# Altium schematic sheet SensorSchematic.SchDoc
size A4; SheetNumber: 1; SheetTotal: 1
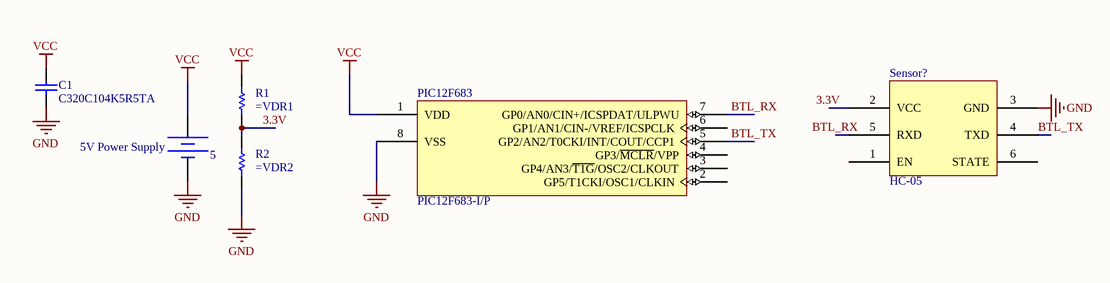
[diagram p0: SensorSchematic.SchDoc]

## Parts
5V_Power_Supply  DC Magnitude: 5  (hidden comment: Constant Voltage Source)
C1  C320C104K5R5TA  [CAPR51-254-508X318X736]
PIC12F683  PIC12F683-I/P  [PDIP300-P8]
R1  Resistor  (value not drawn)
R2  Resistor  (value not drawn)
Sensor?  HC-05  [HC-05]

## Nets
GND: 5V_Power_Supply.2 C1.1 PIC12F683.8(VSS) R2.1 Sensor?.3(GND)
VCC: 5V_Power_Supply.1 C1.2 PIC12F683.1(VDD) R1.1
3.3V: R1.2 R2.2 Sensor?.2(VCC)
BTL_RX: PIC12F683.7(GP0/AN0/CIN+/ICSPDAT/ULPWU) Sensor?.5(RXD)
BTL_TX: PIC12F683.5(GP2/AN2/T0CKI/INT/COUT/CCP1) Sensor?.4(TXD)

Not connected (* = marked no-connect by the designer): PIC12F683 2(GP5/T1CKI/OSC1/CLKIN) 3(GP4/AN3/~{T1G}/OSC2/CLKOUT) 4(GP3/~{MCLR}/VPP) 6(GP1/AN1/CIN-/VREF/ICSPCLK); Sensor? 1(EN) 6(STATE)

## Library data of the parts
5V_Power_Supply = Battery: SimulationGenericComponent: True
C1 = CMP-1664-00004-1: Radial Leaded Multilayer Ceramic Capacitor, 0.1 uF, +/- 10%, 50 V, -55 to 125 degC, 2-Pin THD, RoHS, Tape and Reel; Case\Package: SOT-23-5; Max Power Dissipation: 250 mW; Output Current: 150 mA; Dropout Voltage: 260 mV; Outputs: 1; Output Voltage: 5 V; Max Input Voltage: 8 V; Min Operating Temperature: -40 degC; Packaging: Tape and Reel; Height: 1.3 mm; Radiation Hardening: No; Pins: 5; ComponentLink1Description: Manufacturer URL; Mount: Surface Mount; RoHSCompliant: true; Max Operating Temperature: 85 degC; PackageReference: CAPR51-254-508X318X736; ComponentLink2URL: http://www.kemet.com/docfinder?Partnumber=C320C104K5R5TA; PackageDescription: 2-Pin Through Hole Device, Body 5.08 x 3.18 mm, Pitch 2.54 mm; ComponentLink1URL: http://www.kemet.com/; Width: 1.8 mm; Package Quantity: 3000; DatasheetVersion: Dec-15; Length: 3 mm; ComponentLink2Description: Datasheet
PIC12F683 = CMP-0190-00006-1: Flash-Based 8-Bit CMOS Microcontroller with nanoWatt Technology, 2K (x14-Bit words) Program Memory, 384 Bytes Data Memory, 8-Pin PDIP, Industrial Temperature; PackageDescription: 8-Lead Plastic Dual In-Line (P) - 300 mil Body [PDIP]; PackageVersion: revBB, Aug-2009; Code_JEDEC: MS-001; DatasheetVersion: revD, Feb-2007; PackageReference: PDIP300-P8
R1 R2 = Resistor: TC1: 0; SimulationGenericComponent: True; TC2: 0
  R1: Value: =VDR1
  R2: Value: =VDR2